# EAGLE schematic Dveri_Termotunnel_TRIAC (EAGLE 7.0.0)
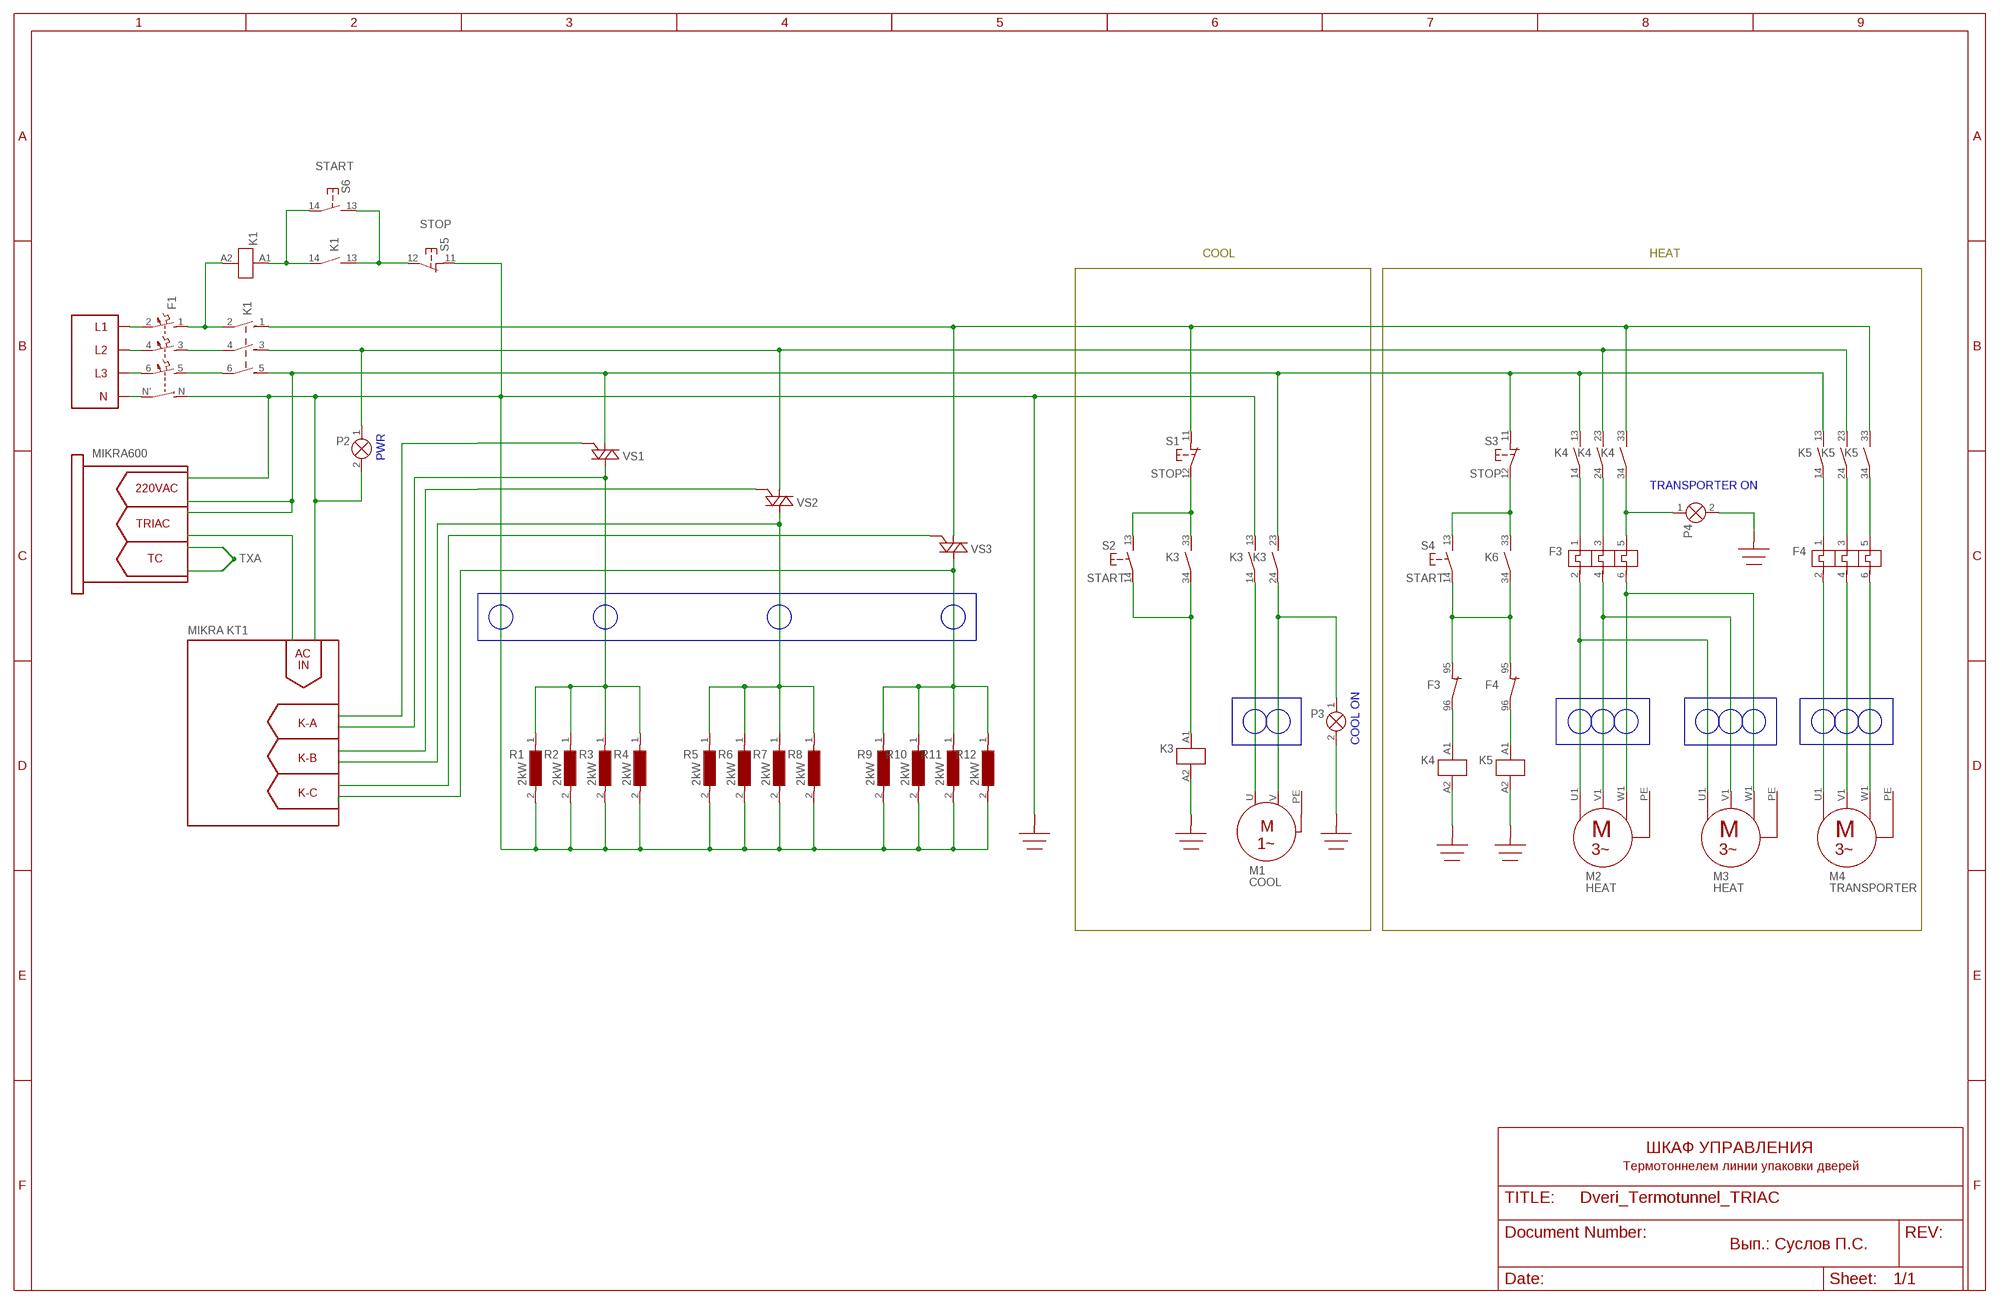
[diagram p0: schematic, sheet 1]

## Parts
F1  LEITUNGSSCHUTZSCHALTER_4-POL  [LEITUNGSSCHUTZSCHALTER_4-POL]
F3  MOTORSCHUTZSCHALTER_3-POL_THERM_AUSLOESUNG_HILFSKONTAKTE  [MOTORSCHUTZSCHALTER_3-POL_THERM_AUSLOESUNG_HILFSKONTAKT_95_96_97_98]
F4  MOTORSCHUTZSCHALTER_3-POL_THERM_AUSLOESUNG_HILFSKONTAKTE  [MOTORSCHUTZSCHALTER_3-POL_THERM_AUSLOESUNG_HILFSKONTAKT_95_96_97_98]
K1  HAUPTSCHUETZ_3-POL_HILFSKONTAKT_13-14  [HAUPTSCHUETZ_3-POL+HILFSKONTAKT_13-14]
K3  HILFSSCHUETZ_13-14_23-24_33_34  [HILFSSCHUETZ_13-14_23-24_33_34]
K4  HILFSSCHUETZ_13-14_23-24_33_34  [HILFSSCHUETZ_13-14_23-24_33_34]
K5  HILFSSCHUETZ_13-14_23-24_33_34  [HILFSSCHUETZ_13-14_23-24_33_34]
K6  HILFSSCHUETZ_13-14_23-24_33_34  [HILFSSCHUETZ_13-14_23-24_33_34]
M1  COOL  MOTOR_1-PHASEN  [MOTOR_1-PHASEN]
M2  HEAT  MOTOR_3-POL_PE  [MOTOR_3-POL_PE]
M3  HEAT  MOTOR_3-POL_PE  [MOTOR_3-POL_PE]
M4  TRANSPORTER  MOTOR_3-POL_PE  [MOTOR_3-POL_PE]
P2  SIGNALLAMPE  [LAMPE]
P3  SIGNALLAMPE  [LAMPE]
P4  SIGNALLAMPE  [LAMPE]
R1  2kW  SPULE  [WICKLUNG]
R2  2kW  SPULE  [WICKLUNG]
R3  2kW  SPULE  [WICKLUNG]
R4  2kW  SPULE  [WICKLUNG]
R5  2kW  SPULE  [WICKLUNG]
R6  2kW  SPULE  [WICKLUNG]
R7  2kW  SPULE  [WICKLUNG]
R8  2kW  SPULE  [WICKLUNG]
R9  2kW  SPULE  [WICKLUNG]
R10  2kW  SPULE  [WICKLUNG]
R11  2kW  SPULE  [WICKLUNG]
R12  2kW  SPULE  [WICKLUNG]
S1  OEFFNER_TASTSCHALTER  [OEFFNER_TASTSCHALTER]
S2  SCHLIESSER_TASTSCHALTER  [SCHLIESSER_TASTSCHALTER]
S3  OEFFNER_TASTSCHALTER  [OEFFNER_TASTSCHALTER]
S4  SCHLIESSER_TASTSCHALTER  [SCHLIESSER_TASTSCHALTER]
S5  OEFFNER_TASTSCHALTER  [OEFFNER_TASTSCHALTER]
S6  SCHLIESSER_TASTSCHALTER  [SCHLIESSER_TASTSCHALTER]
VS1  TRIAC  [TRIAC]
VS2  TRIAC  [TRIAC]
VS3  TRIAC  [TRIAC]
X1  ERDE_ALLGEMEIN  [ERDE_ALLGEMEIN]
X2  ERDE_ALLGEMEIN  [ERDE_ALLGEMEIN]
X3  ERDE_ALLGEMEIN  [ERDE_ALLGEMEIN]
X4  ERDE_ALLGEMEIN  [ERDE_ALLGEMEIN]
X5  ERDE_ALLGEMEIN  [ERDE_ALLGEMEIN]
X7  ERDE_ALLGEMEIN  [ERDE_ALLGEMEIN]

## Nets
A: K1.1 K4.33 K5.33 S1.11 VS3.A2
B: K1.3 K4.23 K5.23 P2.1(X1) VS2.A2
C: K1.5 K3.23 K4.13 K5.13 S3.11 VS1.A2
L1-EXT: F1.2
L2-EXT: F1.4
L3-EXT: F1.6
N: F1.N K3.13 K3.A2 K4.A2 K5.A2 P2.2(X2) P3.2(X2) P4.2(X2) R1.2 R2.2 R3.2 R4.2 R5.2 R6.2 R7.2 R8.2 R9.2 R10.2 R11.2 R12.2 S5.11 X1.1(PE) X2.1(PE) X3.1(PE) X4.1(PE) X5.1(PE) X7.1(PE)
N$2: VS3.G
N$3: VS2.G
N$4: R5.1 R6.1 R7.1 R8.1 VS2.A1
N$5: VS1.G
N$7: K3.24 M1.V P3.1(X1)
N$8: K3.14 M1.U
N$9: F4.1 K5.14
N$10: F4.3 K5.24
N$11: R1.1 R2.1 R3.1 R4.1 VS1.A1
N$12: F4.5 K5.34
N$15: R9.1 R10.1 R11.1 R12.1 VS3.A1
N$16: F3.2 M2.U1 M3.U1
N$17: F3.4 M2.V1 M3.V1
N$18: F3.6 M2.W1 M3.W1
N$19: F4.2 M4.U1
N$20: F4.4 M4.V1
N$21: F4.6 M4.W1
N$22: F3.1 K4.14
N$23: F3.3 K4.24
N$24: F3.5 K4.34 P4.1(X1)
N$25: K3.34 K3.A1 S2.14
N$26: K3.33 S1.12 S2.13
N$27: F3.96 K4.A1
N$28: F3.95 F4.95 K6.34 S4.14
N$29: K6.33 S3.12 S4.13
N$30: F4.96 K5.A1
N$32: F1.1 K1.2 K1.A2(1:A2)
N$37: F1.3 K1.4
N$38: F1.5 K1.6
N$39: K1.14 K1.A1(1:A1) S6.14
N$40: K1.13 S5.12 S6.13
PE-EXT: F1.N'(N)
Unconnected: F3.97 F3.98 F4.97 F4.98 K6.13 K6.14 K6.23 K6.24 K6.A1 K6.A2 M1.PE M2.PE M3.PE M4.PE

## Buses
B$1
B$2
B$3
B$4
B$5

## Notes on the sheet
- START
- STOP
- COOL | HEAT
- MIKRA600 | PWR
- STOP | STOP
- 220VAC | TRANSPORTER ON
- TRIAC
- TC | TXA
- START | START
- COOL ON | COOL ON
- MIKRA KT1
- AC
- IN
- K-A
- COOL ON
- K-B
- K-C
- ШКАФ УПРАВЛЕНИЯ
- Термотоннелем линии упаковки дверей
- Вып.: Суслов П.С.

## Library data of the parts
F1 = e-sicherungen:LEITUNGSSCHUTZSCHALTER_4-POL: Leitungsschutzschalter, 4-pol.
F3 F4 = e-motorschutzschalter:MOTORSCHUTZSCHALTER_3-POL_THERM_AUSLOESUNG_HILFSKONTAKTE: Motorschutzschalter 3-pol. mit thermischer Auslösung, Hilfskontakte
K1 = e-schuetze-relais:HAUPTSCHUETZ_3-POL_HILFSKONTAKT_13-14: Hauptschütz 3-pol. mit Hilfskontakt-Schließer
K3-K6 = e-schuetze-relais:HILFSSCHUETZ_13-14_23-24_33_34: Hilfsschütz mit 3 Schließern
M1 = e-motoren:MOTOR_1-PHASEN: 1-Phasen-Wechselstrom-Motor
M2-M4 = e-motoren:MOTOR_3-POL_PE: 3-Phasen-Motor mit PE
P2-P4 = e-lampen-signalisation:SIGNALLAMPE: Lampe
R1-R12 = e-spulen-transformatoren:SPULE: Spule
S1 S3 S5 = e-schalter:OEFFNER_TASTSCHALTER: Tastschalter, Öffner
S2 S4 S6 = e-schalter:SCHLIESSER_TASTSCHALTER: Tastschalter, Schließer
VS1-VS3 = e-halbleiter:TRIAC: Triac
X1-X5 X7 = e-klemmen:ERDE_ALLGEMEIN: Erde allgemein